# EAGLE schematic 6switch (EAGLE 8.3.2)
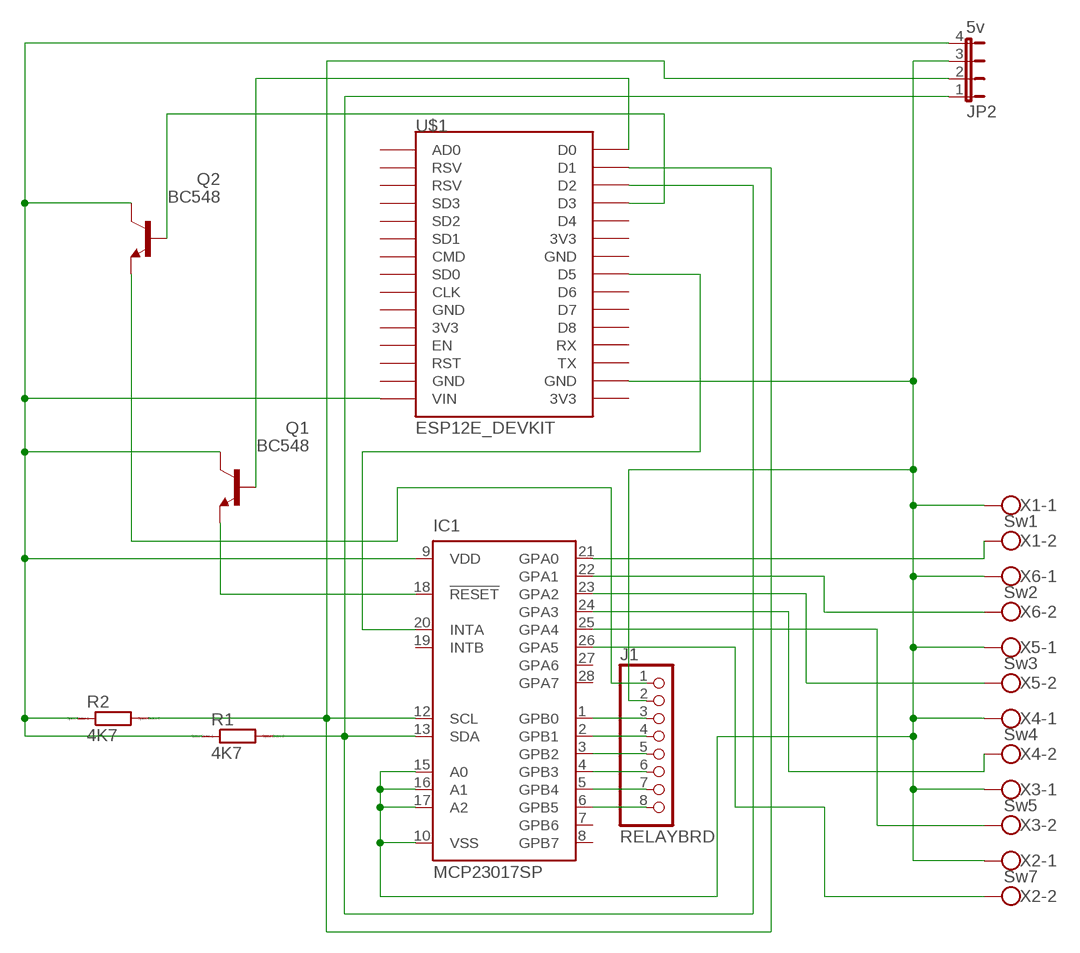
[diagram p0: schematic, sheet 1]

## Parts
IC1  MCP23017SP  [DIL28-3]
J1  RELAYBRD  PINHD-1X8  [1X08]
JP2  5v  JP4E  [JP4]
Q1  BC548  [TO92-EBC]
Q2  BC548  [TO92-EBC]
R1  4K7  R0207/10  [0207/10]
R2  4K7  R0207/10  [0207/10]
U$1  ESP12E_DEVKIT  [ESP12E_DEVKIT]
X1  Sw1  W237-102  [W237-102]
X2  Sw7  W237-102  [W237-102]
X3  Sw5  W237-102  [W237-102]
X4  Sw4  W237-102  [W237-102]
X5  Sw3  W237-102  [W237-102]
X6  Sw2  W237-102  [W237-102]

## Nets
GND: IC1.10(VSS) IC1.15(A0) IC1.16(A1) IC1.17(A2) J1.2 JP2.3 U$1.GND@3(GND) X1.1 X2.1 X3.1 X4.1 X5.1 X6.1
N$1: Q1.B U$1.D0
N$2: IC1.18(!RESET) Q1.E
N$3: J1.1 Q2.E
N$4: Q2.B U$1.D3
N$5: IC1.22(GPA1) X6.2
N$6: IC1.1(GPB0) J1.3
N$7: IC1.20(INTA) U$1.D5
N$8: IC1.23(GPA2) X5.2
N$9: IC1.24(GPA3) X4.2
N$10: IC1.21(GPA0) X1.2
N$11: IC1.2(GPB1) J1.4
N$12: IC1.3(GPB2) J1.5
N$13: IC1.4(GPB3) J1.6
N$14: IC1.5(GPB4) J1.7
N$15: IC1.6(GPB5) J1.8
N$16: IC1.25(GPA4) X3.2
N$17: IC1.26(GPA5) X2.2
SCL: IC1.12(SCL) JP2.2 R2.2 U$1.D1
SDA: IC1.13(SDA) JP2.1 R1.2 U$1.D2
VCC: IC1.9(VDD) JP2.4 Q1.C Q2.C R1.1 R2.1 U$1.VIN
Unconnected: IC1.7(GPB6) IC1.8(GPB7) IC1.19(INTB) IC1.27(GPA6) IC1.28(GPA7) U$1.3V3@0(3V3) U$1.3V3@1(3V3) U$1.3V3@2(3V3) U$1.AD0 U$1.CLK U$1.CMD U$1.D4 U$1.D6 U$1.D7 U$1.D8 U$1.EN U$1.GND@0(GND) U$1.GND@1(GND) U$1.GND@2(GND) U$1.RST U$1.RSV@0(RSV) U$1.RSV@1(RSV) U$1.RX U$1.SD0 U$1.SD1 U$1.SD2 U$1.SD3 U$1.TX

## Library data of the parts
IC1 = microchip:MCP23017: http://ww1.microchip.com/downloads/en/DeviceDoc/21952a.pdf Source: http://ww1.microchip.com/downloads/en/DeviceDoc/21952a.pdf; MF: MICROCHIP; MPN: MCP23017-E/SP; OC_FARNELL: 1332088; OC_NEWARK: 31K2959
J1 = pinhead:PINHD-1X8: PIN HEADER
JP2 = jumper:JP4E: JUMPER
Q1 Q2 = transistor-npn:BC548*: NPN Transistor
R1 R2 = eagle-ltspice:R: RESISTOR, European symbol; SPICEMODEL: NONE; SPICEPREFIX: R
U$1 = ESP12E_DEVKIT:ESP12E_DEVKIT: ESP12E DEVKIT BOARD
X1-X6 = con-wago-500:W237-102: WAGO SCREW CLAMP; MPN: 237-102; OC_FARNELL: unknown; OC_NEWARK: 70K9898